# Altium project Control BoardPrjPcb.PrjPcb (part 2 of 2)

## Sheet USB.SchDoc
size A4; SheetNumber: 7; SheetTotal: 9
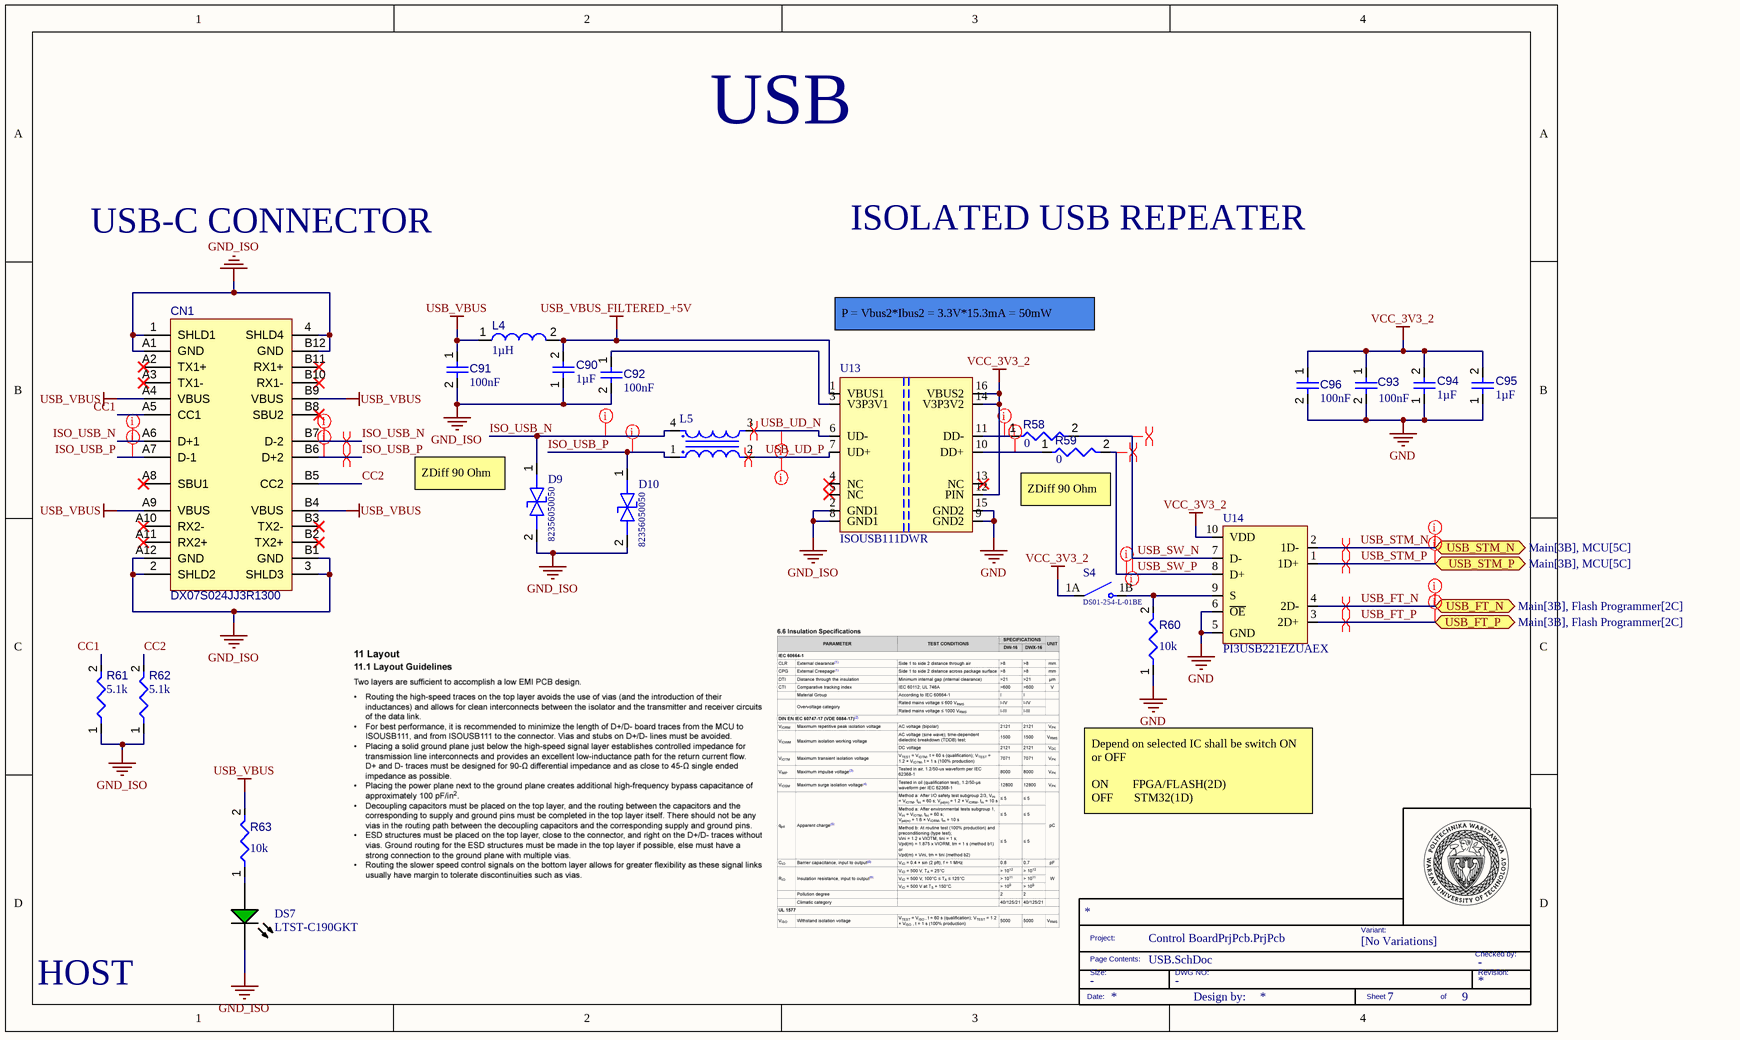
[diagram p5: USB.SchDoc]

### Parts
(Parts that share a designator on the sheet are numbered #1, #2 ... from top to bottom, then left to right.)
*?#5  TITLE_BLOCK  (value not drawn)  (graphical)
C90  value 1µF  [FP-CL10-IPC_C]  (hidden comment: CL10B105KA8NFNC)
C91  value 100nF  [FP-C0603C-CF-IPC_B]  (hidden comment: C0603C104K5RAC7411)
C92  value 100nF  [FP-C0603C-CF-IPC_B]  (hidden comment: C0603C104K5RAC7411)
C93  value 100nF  [FP-C0603C-CF-IPC_C]  (hidden comment: C0603C104K5RAC7411)
C94  value 1µF  [FP-CL10-IPC_B]  (hidden comment: CL10B105KA8NFNC)
C95  value 1µF  [FP-CL10-IPC_B]  (hidden comment: CL10B105KA8NFNC)
C96  value 100nF  [FP-C0603C-CF-IPC_C]  (hidden comment: C0603C104K5RAC7411)
CN1  DX07S024JJ3R1300  [JAE-DX07S024JJ3_V]
D9  82356050050  [0603]
D10  82356050050  [0603]
DS7  LTST-C190GKT  [LTST-C190GKT_V]
L4  value 1µH  [INDC2520X120X60NL20T20]  (hidden comment: LQM2HPN1R0MJ0L)
L5  SRF4532-1R0Y  [SRF4532-1R0Y-Footprint-1]  (value not drawn)
R58  value 0  [RESC0603(1608)_L]  (hidden comment: 0R3J)
R59  value 0  [RESC0603(1608)_L]  (hidden comment: 0R3J)
R60  value 10k  [RESC1608X05N]  (hidden comment: CRCW060310K0FKTC)
R61  value 5.1k  [RESC1608X55X25LL10T15]  (hidden comment: 0603SAF5101T5E)
R62  value 5.1k  [RESC1608X55X25LL10T15]  (hidden comment: 0603SAF5101T5E)
R63  value 10k  [RESC1608X05N]  (hidden comment: CRCW060310K0FKTC)
S4  DS01-254-L-01BE  [SW_DS01-254-L-01BE]
U13  ISOUSB111DWR  [SOIC127P1030X265-16N]
U14  PI3USB221EZUAEX  [PI3USB221EZUAEX-Footprint-1]

### Ports
USB_FT_N (bidir, see Main[3B], Flash Programmer[2C]), USB_FT_P (bidir, see Main[3B], Flash Programmer[2C]), USB_STM_N (bidir, see Main[3B], MCU[5C]), USB_STM_P (bidir, see Main[3B], MCU[5C])

### Nets
GND: C93.2 C94.1 C95.1 C96.2 R60.1 U13.9(GND2) U13.15(GND2) U14.5(GND) U14.6(~{OE})
GND_ISO: C90.1 C91.2 C92.2 CN1.1(SHLD1) CN1.2(SHLD2) CN1.3(SHLD3) CN1.4(SHLD4) CN1.A1(GND) CN1.A12(GND) CN1.B1(GND) CN1.B12(GND) D9.2(A) D10.2(A) DS7.2(K) R61.1 R62.1 U13.2(GND1) U13.8(GND1)
USB_VBUS: C91.1 CN1.A4(VBUS) CN1.A9(VBUS) CN1.B4(VBUS) CN1.B9(VBUS) L4.1 R63.2
USB_VBUS_FILTERED_+5V: C90.2 L4.2 U13.1(VBUS1)
VCC_3V3_2: C93.1 C94.2 C95.2 C96.1 S4.1A(COM1) U13.12(PIN) U13.14(V3P3V2) U13.16(VBUS2) U14.10(VDD)
CC1: CN1.A5(CC1) R61.2
CC2: CN1.B5(CC2) R62.2
ISO_USB_N: CN1.A6(D+1) CN1.B7(D-2) D9.1(K) L5.4
ISO_USB_P: CN1.A7(D-1) CN1.B6(D+2) D10.1(K) L5.1
USB_FT_N: U14.4(2D-) ; port USB_FT_N
USB_FT_P: U14.3(2D+) ; port USB_FT_P
USB_STM_N: U14.2(1D-) ; port USB_STM_N
USB_STM_P: U14.1(1D+) ; port USB_STM_P
USB_SW_N: R58.2 U14.7(D-)
USB_SW_P: R59.2 U14.8(D+)
USB_UD_N: L5.3 U13.6(UD-)
USB_UD_P: L5.2 U13.7(UD+)
NetC92_1: C92.1 U13.3(V3P3V1)
NetDS7_1: DS7.1(A) R63.1
NetR58_1: R58.1 U13.11(DD-)
NetR59_1: R59.1 U13.10(DD+)
NetR60_2: R60.2 S4.1B(NO1) U14.9(S)

Not connected (* = marked no-connect by the designer): CN1 A2(TX1+)* A3(TX1-)* A8(SBU1)* A10(RX2-)* A11(RX2+)* B2(TX2+)* B3(TX2-)* B8(SBU2)* B10(RX1-)* B11(RX1+)*; U13 4(NC)* 5(NC)* 13(NC)*

### Layout directives
differential pair: ISO_USB_N, ISO_USB_P, USB_FT_N, USB_FT_P, USB_STM_N, USB_STM_P, USB_SW_N, USB_SW_P, USB_UD_N, USB_UD_P
mark named USB: ISO_USB_N, ISO_USB_P, NetR58_1, NetR59_1, USB_FT_N, USB_FT_P, USB_STM_N, USB_STM_P, USB_SW_N, USB_SW_P, USB_UD_N, USB_UD_P

### Notes on the sheet
- USB
- USB-C CONNECTOR
- ISOLATED USB REPEATER
- P = Vbus2*Ibus2 = 3.3V*15.3mA = 50mW
- (near D9) ZDiff 90 Ohm
- (near R59) ZDiff 90 Ohm
- Depend on selected IC shall be switch ON or OFF
  ON        FPGA/FLASH(2D)
  OFF       STM32(1D)
- HOST
- (in symbol CMP-003-000005-7) Variant:; Project:; [No Variations]; Checked by:; Page Contents:; Size:; DWG NO:; Revision:; Date:; Design by:; Sheet; of

### Library data of the parts
*?#5 = CMP-003-000005-7: TITLEBLOCK; DWG NO: -; Size: -; Checked by: -; Design Item ID: TITLE_BLOCK; Source: TITLEBLOCK.SchLib
C90 C94 C95 = CMP-001-00085-5: Ceramic Capacitor, Multilayer, Ceramic, 25V, 10% +Tol, 10% -Tol, X7R, 15% TC, 1uF, Surface Mount, 0603; Max Operating Temperature: 125°C; Pins: 2; RoHS Compliant: Yes; Min Operating Temperature: -55°C; Capacitor Type: Ceramic; Mounting Technology: Surface Mount; Case/Package: 0603
C91-C93 C96 = CMP-001-00086-8: Ceramic Capacitor, Multilayer, Ceramic, 50V, 10% +Tol, 10% -Tol, X7R, 15% TC, 0.1uF, Surface Mount, 0603; Capacitor Type: Ceramic; Max Operating Temperature: 125°C; Case/Package: 0603; Pins: 2; Min Operating Temperature: -55°C; RoHS Compliant: Yes; Mounting Technology: Surface Mount
CN1 = CMP-002-00065-4: USB-C Connector, 20 V, 1.25 A, -30 to 80 degC, RoHS, Tape and Reel; Gender: Receptacle; Connector Type: USB-C; Pins: 28
D9 D10 = CMP-004-00031-1: Trans Voltage Suppressor Diode, 5V V(RWM), Bidirectional, 1 Element, Silicon; Peak Inverse Voltage: 75V; Case/Package: 0603; Min Operating Temperature: -40°C; Max Operating Temperature: 85°C; RoHS Compliant: Yes; Pins: 2
DS7 = CMP-007-00022-2: LED Uni-Color Green, 100 mW, 30 mA, -55 to 85 degC, 2-Pin SMD, RoHS, Tape and Reel; Manufacturer: Lite-On; Power: 100mW; Forward Voltage: 2.1V; Viewing Angle: 130degrees; Forward Current: 20mA; Luminous Intensity: 6mcd; Lens Style: Clear; Manufacturer URL: http://www.us.liteon.com/; RoHS Compliant: True; Colour: Green; Package Description: 2-Pin Surface Mount Device, Body 1.6 x 0.8 mm; Datasheet URL: http://datasheet.octopart.com/LTST-C190GKT-Lite-On-datasheet-158530.pdf; Datasheet Version: Dec-06; Mounting Technology: SM; Case/Package: 0603; Package Reference: C190GKT; Packaging: TapeandReel; Min Operating Temperature: -55°C; Nominal Vf: 2.1V; Package Quantity: 3000; Illumination Colour: Green; Max Operating Temperature: 85°C; Pins: 2
L4 = CMP-006-00008-6: Chip Inductor, 1 uH, +/- 20%, 1 MHz, -55 to 125 degC, 1008 (2520 Metric), RoHS, Tape and Reel; Manufacturer: Murata; Self Resonant Frequency: 70MHz; Current Rating: 1.5A; Shielding: Shielded; Core Material: Ferrite; Resistance: 0.09Ohm; Datasheet URL: http://psearch.en.murata.com/inductor/product/LQM2HPN1R0MJ0%23.pdf; Datasheet Version: Aug-16; RoHS Compliant: True; Case/Package: 1008; Package Description: 2-Pin Surface Mount Device, Body 2.5 x 2 mm; Package Quantity: 3000; Tolerance: 20%; Min Operating Temperature: -40°C; Package Reference: 1008; Packaging: TapeandReel; Mounting Technology: SM; Max Operating Temperature: 85°C
L5 = CMP-006-00026-1: Data Line Filter, 2 Function(s), 50V, 1.2A, 4 Pin(s); RoHS Compliant: Yes
R58 R59 = CMP-009-00063-3: Jumper 0603 (1608 Metric); Case/Package: 0603; Mounting Technology: SMT; Pins: 2
R60 R63 = CMP-009-00187-2: Fixed Resistor, Metal Glaze/thick Film, 0.1W, 10000ohm, 75V, 1% +/-Tol, 100ppm/Cel, Surface Mount, 0603; Power: 100mW; Voltage Rating: 75V; Case/Package: 0603; Tolerance: 1%; Min Operating Temperature: -55°C; Mounting Technology: Surface Mount; Max Operating Temperature: 155°C; RoHS Compliant: No; Pins: 2
R61 R62 = CMP-009-00212-2: Chip Resistor, 5.1 KOhm, +/- 1%, 01 W, -55 to 155 degC, 0603 (1608 Metric); Power: 100mW; Voltage Rating: 50V; Case/Package: 0603; RoHS Compliant: True; Max Operating Temperature: 155°C; Min Operating Temperature: -55°C; Tolerance: 1%; Mounting Technology: SM; Pins: 2
S4 = CMP-011-00013-2: 1 Position, Through Hole, 2.54 mm Pitch, Raised Slide Actuator, Flat Bottom, Long Pin, DIP Switch; MF: CUI Devices; SnapEDA_Link: https://www.snapeda.com/parts/DS01-254-L-01BE/CUI+Devices/view-part/?ref=snap; Purchase-URL: https://pricing.snapeda.com/search/part/DS01-254-L-01BE/?ref=eda; Price: None; Value: *; MP: DS01-254-L-01BE; Component Type: Standard; CUI_purchase_URL: https://www.cuidevices.com/product/switches/dip-switches/ds01-254-series?utm_source=snapeda.com&utm_medium=referral&utm_campaign=snapedaBOM; Case/Package: None; Design Item ID: DS01-254-L-01BE; Pins: 2; Check_prices: https://www.snapeda.com/parts/DS01-254-L-01BE/CUI+Devices/view-part/?ref=eda; Source: DS01-254-L-01BE.SchLib; Availability: In Stock
U13 = CMP-031-00011-4: USB Interface IC Low emissions, full/low speed isolated USB repeater; Min Supply Voltage: 4.25V; Max Supply Voltage: 5.5V; Case/Package: SOIC-16; Min Operating Temperature: -40°C; Max Operating Temperature: 125°C; Pins: 16
U14 = CMP-031-00023-2: Analog Multiplexer Single 1: 2 10-Pin UQFN T/R; Pins: 10; Min Operating Temperature: -40°C; RoHS Compliant: Yes; Max Operating Temperature: 85°C

## Sheet Flash.SchDoc
size A4; SheetNumber: 5; SheetTotal: 9
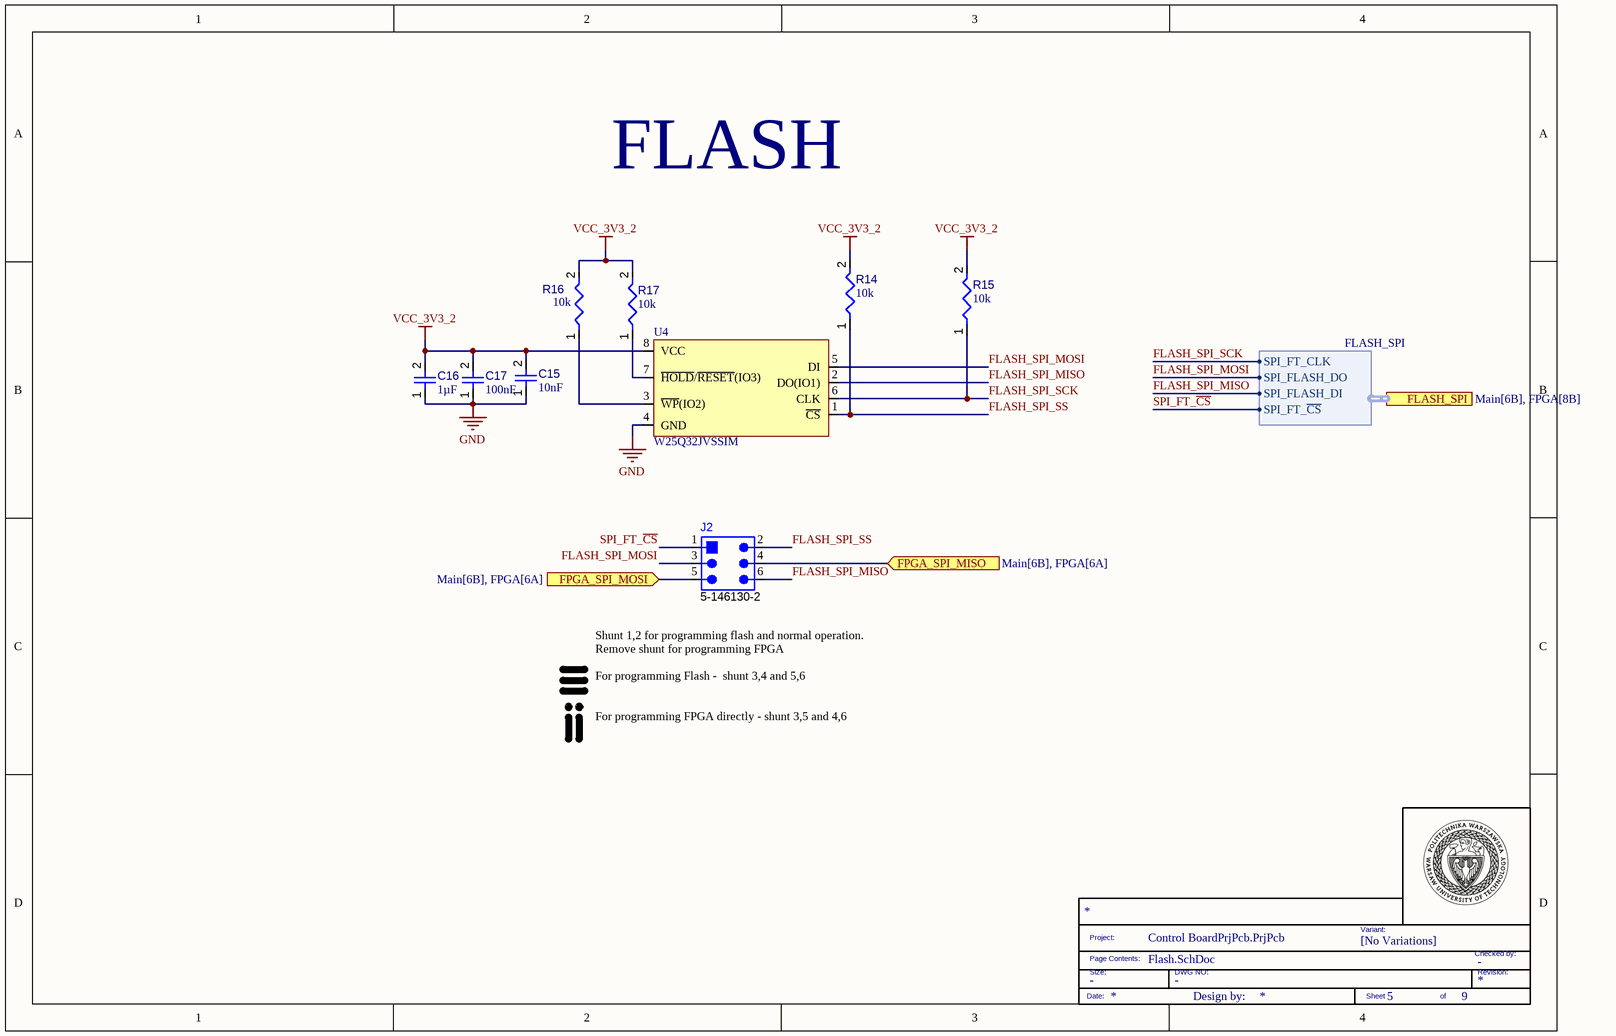
[diagram p6: Flash.SchDoc]

### Parts
(Parts that share a designator on the sheet are numbered #1, #2 ... from top to bottom, then left to right.)
*#2  TITLE_BLOCK  (value not drawn)  (graphical)
C15  value 10nF  [CAPC1608X90X35LL10T15]  (hidden comment: GCM188R71H103KA37J)
C16  value 1µF  [FP-CL10-IPC_C]  (hidden comment: CL10B105KA8NFNC)
C17  value 100nF  [FP-C0603C-CF-IPC_C]  (hidden comment: C0603C104K5RAC7411)
J2  5-146130-2  [TECO-5-146130-2_V]
R14  value 10k  [RESC1608X05N]  (hidden comment: CRCW060310K0FKTC)
R15  value 10k  [RESC1608X05N]  (hidden comment: CRCW060310K0FKTC)
R16  value 10k  [RESC1608X05N]  (hidden comment: CRCW060310K0FKTC)
R17  value 10k  [RESC1608X05N]  (hidden comment: CRCW060310K0FKTC)
U4  W25Q32JVSSIM  [SOIC127P790X175-8N]

### Ports
FLASH_SPI (harness FLASH_SPI, see Main[6B], FPGA[8B]), FPGA_SPI_MISO (in, see Main[6B], FPGA[6A]), FPGA_SPI_MOSI (in, see Main[6B], FPGA[6A])

### Harnesses
FLASH_SPI: SPI_FT_CLK, SPI_FLASH_DO, SPI_FLASH_DI, SPI_FT_~{CS}

### Nets
GND: C15.1 C16.1 C17.1 U4.4(GND)
VCC_3V3_2: C15.2 C16.2 C17.2 R14.2 R15.2 R16.2 R17.2 U4.8(VCC)
FLASH_SPI_MISO: J2.6 U4.2(DO(IO1)) ; port FLASH_SPI.SPI_FLASH_DI
FLASH_SPI_MOSI: J2.3 U4.5(DI) ; port FLASH_SPI.SPI_FLASH_DO
FLASH_SPI_SCK: R15.1 U4.6(CLK) ; port FLASH_SPI.SPI_FT_CLK
FLASH_SPI_SS: J2.2 R14.1 U4.1(~{CS})
FPGA_SPI_MISO: J2.4 ; port FPGA_SPI_MISO
FPGA_SPI_MOSI: J2.5 ; port FPGA_SPI_MOSI
SPI_FT_~{CS}: J2.1 ; port FLASH_SPI.SPI_FT_~{CS}  [project net SPI_FPGA_~{CS}]
NetR16_1: R16.1 U4.3(~{WP}(IO2))
NetR17_1: R17.1 U4.7(~{HOLD}/~{RESET}(IO3))

### Notes on the sheet
- FLASH
- (near J2) Shunt 1,2 for programming flash and normal operation. Remove shunt for programming FPGA
  For programming Flash -  shunt 3,4 and 5,6
  For programming FPGA directly - shunt 3,5 and 4,6
- (in symbol CMP-003-000005-7) Variant:; Project:; [No Variations]; Checked by:; Page Contents:; Size:; DWG NO:; Revision:; Date:; Design by:; Sheet; of

### Library data of the parts
*#2 = CMP-003-000005-7: TITLEBLOCK; DWG NO: -; Size: -; Checked by: -; Design Item ID: TITLE_BLOCK; Source: TITLEBLOCK.SchLib
C15 = CMP-001-00231-2: Ceramic Capacitor, Multilayer, Ceramic, 50V, 10% +Tol, 10% -Tol, X7R, 15% TC, 0.01uF, Surface Mount, 0603; Min Operating Temperature: -55°C; Voltage Rating: 50V; Max Operating Temperature: 125°C; Tolerance: 10%; Capacitor Type: Ceramic; Mounting Technology: Surface Mount; RoHS Compliant: Yes; Case/Package: 0603; Pins: 2
C16 = CMP-001-00085-5: as C90 on sheet USB; Max Operating Temperature: 125°C; Pins: 2; RoHS Compliant: Yes; Min Operating Temperature: -55°C; Capacitor Type: Ceramic; Mounting Technology: Surface Mount; Case/Package: 0603
C17 = CMP-001-00086-8: as C91 on sheet USB; Capacitor Type: Ceramic; Max Operating Temperature: 125°C; Case/Package: 0603; Pins: 2; Min Operating Temperature: -55°C; RoHS Compliant: Yes; Mounting Technology: Surface Mount
J2 = CMP-002-00018-3: Male Header, Pitch 2.54 mm, 2 x 3 Position, Height 8.13 mm, -65 to 125 degC, RoHS, Tube; Manufacturer: TE Connectivity; Datasheet Version: Oct-15; RoHS Compliant: Unknown; Min Operating Temperature: -65°C; Max Operating Temperature: 125°C; Datasheet URL: http://www.te.com/commerce/DocumentDelivery/DDEController?Action=showdoc&DocId=Customer+Drawing%7F146130%7FM%7Fpdf%7FEnglish%7FENG_CD_146130_M.pdf%7F5-146130-2; Package Reference: 5-146130-2; Manufacturer URL: http://www.te.com/; Mounting Technology: SM; Package Description: Male Header, Pitch 2.54 mm, 2 x 3 Position, Height 8.13 mm; Connector Type: Header; Case/Package: 5-146130-2; Gender: Male
R14-R17 = CMP-009-00187-2: as R60 on sheet USB; Voltage Rating: 75V; Case/Package: 0603; Tolerance: 1%; Min Operating Temperature: -55°C; Mounting Technology: Surface Mount; Max Operating Temperature: 155°C; RoHS Compliant: No; Pins: 2
U4 = CMP-019-00049-1: Flash, 4MX8, PDSO8; Memory Size: 4194304; Max Supply Voltage: 3.6V; Min Supply Voltage: 2.7V; Clock Frequency: 133MHz; RoHS Compliant: Yes; Memory Format: FLASH; Pins: 8; Max Operating Temperature: 85°C; Case/Package: SOP; Min Operating Temperature: -40°C

## Sheet Flash Programmer.SchDoc
size A4; SheetNumber: 4; SheetTotal: 9
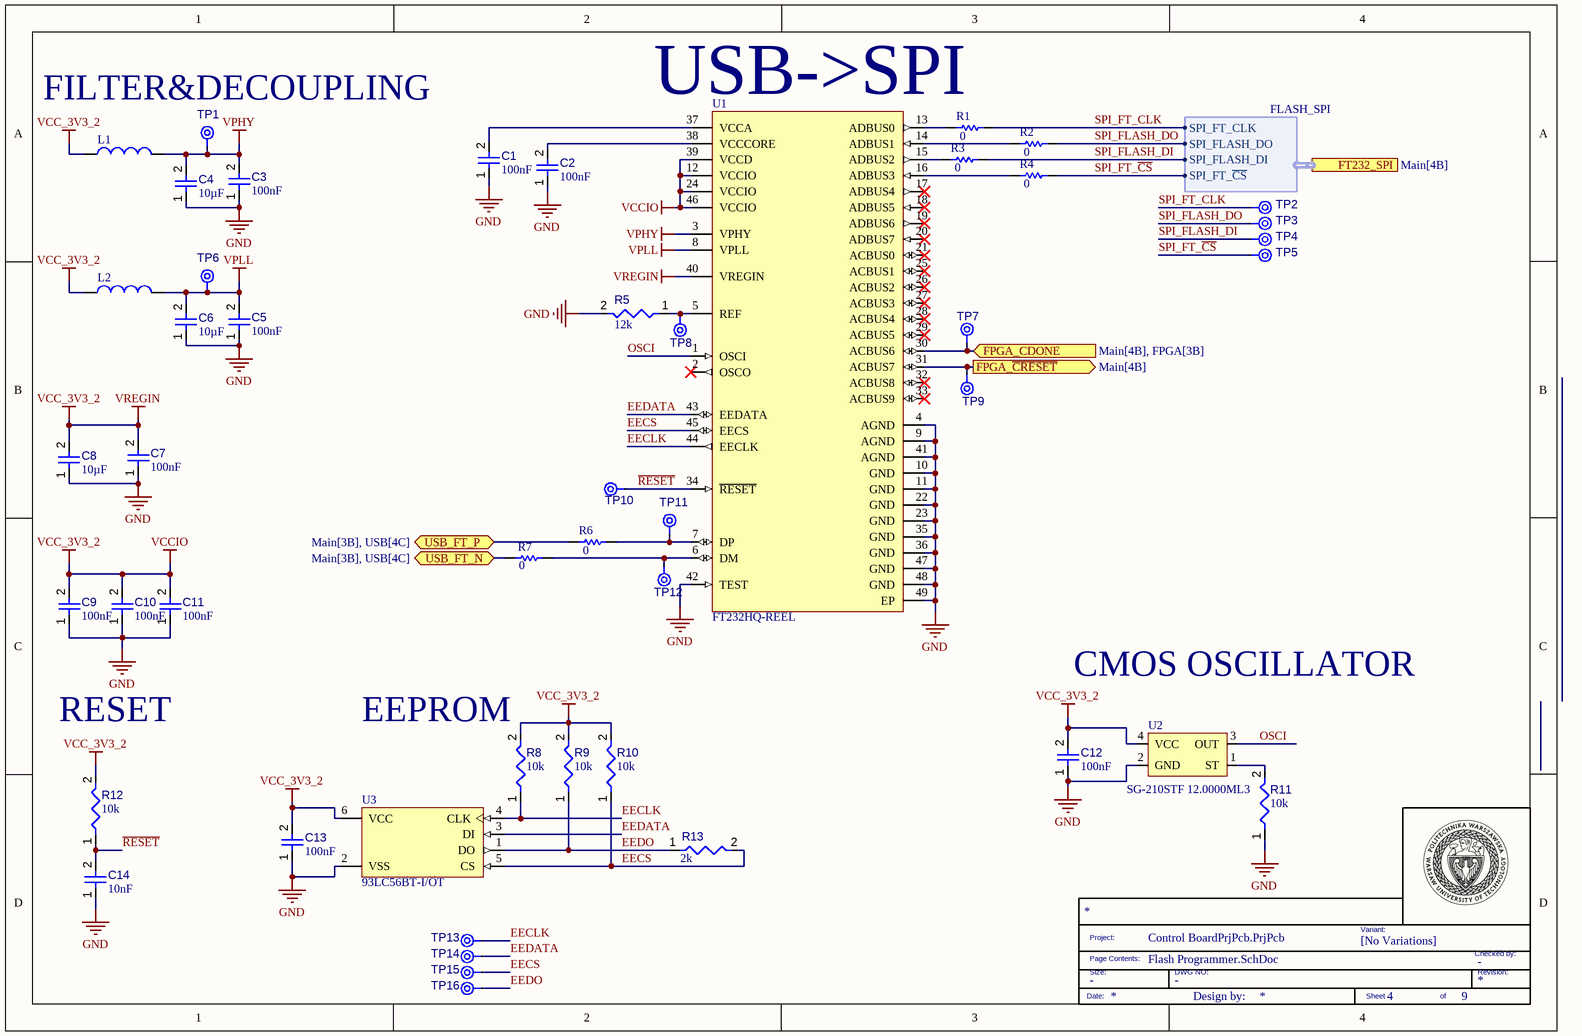
[diagram p7: Flash Programmer.SchDoc]

### Parts
(Parts that share a designator on the sheet are numbered #1, #2 ... from top to bottom, then left to right.)
*?#6  TITLE_BLOCK  (value not drawn)  (graphical)
C1  value 100nF  [FP-C0603C-CF-IPC_C]  (hidden comment: C0603C104K5RAC7411)
C2  value 100nF  [FP-C0603C-CF-IPC_C]  (hidden comment: C0603C104K5RAC7411)
C3  value 100nF  [FP-C0603C-CF-IPC_C]  (hidden comment: C0603C104K5RAC7411)
C4  value 10µF  [FP-GRM188-0_2-IPC_C]  (hidden comment: GRM188R61C106MA73D)
C5  value 100nF  [FP-C0603C-CF-IPC_C]  (hidden comment: C0603C104K5RAC7411)
C6  value 10µF  [FP-GRM188-0_2-IPC_C]  (hidden comment: GRM188R61C106MA73D)
C7  value 100nF  [FP-C0603C-CF-IPC_C]  (hidden comment: C0603C104K5RAC7411)
C8  value 10µF  [FP-GRM188-0_2-IPC_C]  (hidden comment: GRM188R61C106MA73D)
C9  value 100nF  [FP-C0603C-CF-IPC_C]  (hidden comment: C0603C104K5RAC7411)
C10  value 100nF  [FP-C0603C-CF-IPC_C]  (hidden comment: C0603C104K5RAC7411)
C11  value 100nF  [FP-C0603C-CF-IPC_C]  (hidden comment: C0603C104K5RAC7411)
C12  value 100nF  [FP-C0603C-CF-IPC_C]  (hidden comment: C0603C104K5RAC7411)
C13  value 100nF  [FP-C0603C-CF-IPC_C]  (hidden comment: C0603C104K5RAC7411)
C14  value 10nF  [CAPC1608X90X35LL10T15]  (hidden comment: GCM188R71H103KA37J)
L1  MPZ1608Y101BTA00  [FP-MPZ1608-0_8-IPC_C]  (value not drawn)
L2  MPZ1608Y101BTA00  [FP-MPZ1608-0_8-IPC_C]  (value not drawn)
R1  value 0  [RESC1005X40X25ML05T10]  (hidden comment: Resistor 0R 0402 63 mW)
R2  value 0  [RESC1005X40X25ML05T10]  (hidden comment: Resistor 0R 0402 63 mW)
R3  value 0  [RESC1005X40X25ML05T10]  (hidden comment: Resistor 0R 0402 63 mW)
R4  value 0  [RESC1005X40X25ML05T10]  (hidden comment: Resistor 0R 0402 63 mW)
R5  value 12k  [RESC1608X06N]  (hidden comment: RCS060312K0FKEA)
R6  value 0  [RESC1005X40X25ML05T10]  (hidden comment: Resistor 0R 0402 63 mW)
R7  value 0  [RESC1005X40X25ML05T10]  (hidden comment: Resistor 0R 0402 63 mW)
R8  value 10k  [RESC1608X05N]  (hidden comment: CRCW060310K0FKTC)
R9  value 10k  [RESC1608X05N]  (hidden comment: CRCW060310K0FKTC)
R10  value 10k  [RESC1608X05N]  (hidden comment: CRCW060310K0FKTC)
R11  value 10k  [RESC1608X05N]  (hidden comment: CRCW060310K0FKTC)
R12  value 10k  [RESC1608X05N]  (hidden comment: CRCW060310K0FKTC)
R13  value 2k  [RESC1608X06N]  (hidden comment: CRCW06032K00FKEAC)
TP1  TPAD6R  [TP06R]  (value not drawn)  (no BOM)
TP2  TPAD6R  [TP06R]  (value not drawn)  (no BOM)
TP3  TPAD6R  [TP06R]  (value not drawn)  (no BOM)
TP4  TPAD6R  [TP06R]  (value not drawn)  (no BOM)
TP5  TPAD6R  [TP06R]  (value not drawn)  (no BOM)
TP6  TPAD6R  [TP06R]  (value not drawn)  (no BOM)
TP7  TPAD6R  [TP06R]  (value not drawn)  (no BOM)
TP8  TPAD6R  [TP06R]  (value not drawn)  (no BOM)
TP9  TPAD6R  [TP06R]  (value not drawn)  (no BOM)
TP10  TPAD6R  [TP06R]  (value not drawn)  (no BOM)
TP11  TPAD6R  [TP06R]  (value not drawn)  (no BOM)
TP12  TPAD6R  [TP06R]  (value not drawn)  (no BOM)
TP13  TPAD6R  [TP06R]  (value not drawn)  (no BOM)
TP14  TPAD6R  [TP06R]  (value not drawn)  (no BOM)
TP15  TPAD6R  [TP06R]  (value not drawn)  (no BOM)
TP16  TPAD6R  [TP06R]  (value not drawn)  (no BOM)
U1  FT232HQ-REEL  [FP-QFN-48-IPC_A]
U2  SG-210STF 12.0000ML3  [SG-210STF 12.0000ML3-Footprint-1]
U3  93LC56BT-I/OT  [FP-C04-028-MFG]

### Ports
FPGA_CDONE (in, see Main[4B], FPGA[3B]), FPGA_~{CRESET} (out, see Main[4B]), FT232_SPI (harness FLASH_SPI, see Main[4B]), USB_FT_N (bidir, see Main[3B], USB[4C]), USB_FT_P (bidir, see Main[3B], USB[4C])

### Harnesses
FLASH_SPI: SPI_FT_CLK, SPI_FLASH_DO, SPI_FLASH_DI, SPI_FT_~{CS}

### Nets
GND: C1.1 C2.1 C3.1 C4.1 C5.1 C6.1 C7.1 C8.1 C9.1 C10.1 C11.1 C12.1 C13.1 C14.1 R5.2 R11.1 U1.4(AGND) U1.9(AGND) U1.10(GND) U1.11(GND) U1.22(GND) U1.23(GND) U1.35(GND) U1.36(GND) U1.41(AGND) U1.42(TEST) U1.47(GND) U1.48(GND) U1.49(EP) U2.2(GND) U3.2(VSS)
VCC_3V3_2: C7.2 C8.2 C9.2 C10.2 C11.2 C12.2 C13.2 L1.1 L2.1 R8.2 R9.2 R10.2 R12.2 U1.12(VCCIO) U1.24(VCCIO) U1.39(VCCD) U1.40(VREGIN) U1.46(VCCIO) U2.4(VCC) U3.6(VCC)  [also labelled VCCIO, VREGIN]
VPHY: C3.2 C4.2 L1.2 TP1.1(TP) U1.3(VPHY)
VPLL: C5.2 C6.2 L2.2 TP6.1(TP) U1.8(VPLL)
~{RESET}: C14.2 R12.1 TP10.1(TP) U1.34(~{RESET})
~{CRESET}: TP9.1(TP) U1.31(ACBUS7) ; port FPGA_~{CRESET}
CDONE: TP7.1(TP) U1.30(ACBUS6) ; port FPGA_CDONE
EECLK: R8.1 TP13.1(TP) U1.44(EECLK) U3.4(CLK)
EECS: R10.1 R13.2 TP15.1(TP) U1.45(EECS) U3.5(CS)
EEDATA: TP14.1(TP) U1.43(EEDATA) U3.3(DI)
EEDO: R9.1 R13.1 TP16.1(TP) U3.1(DO)
OSCI: U1.1(OSCI) U2.3(OUT)
SPI_FLASH_DI: R3.2 TP4.1(TP) ; port FT232_SPI.SPI_FLASH_DI  [project net FLASH_SPI_MISO]
SPI_FLASH_DO: R2.2 TP3.1(TP) ; port FT232_SPI.SPI_FLASH_DO  [project net FLASH_SPI_MOSI]
SPI_FT_~{CS}: R4.2 TP5.1(TP) ; port FT232_SPI.SPI_FT_~{CS}  [project net SPI_FPGA_~{CS}]
SPI_FT_CLK: R1.2 TP2.1(TP) ; port FT232_SPI.SPI_FT_CLK  [project net FLASH_SPI_SCK]
USB_FT_N: R7.1 ; port USB_FT_N
USB_FT_P: R6.1 ; port USB_FT_P
NetC1_2: C1.2 U1.37(VCCA)
NetC2_2: C2.2 U1.38(VCCCORE)
NetR1_1: R1.1 U1.13(ADBUS0)
NetR2_1: R2.1 U1.14(ADBUS1)
NetR3_1: R3.1 U1.15(ADBUS2)
NetR4_1: R4.1 U1.16(ADBUS3)
NetR5_1: R5.1 TP8.1(TP) U1.5(REF)
NetR6_2: R6.2 TP11.1(TP) U1.7(DP)
NetR7_2: R7.2 TP12.1(TP) U1.6(DM)
NetR11_2: R11.2 U2.1(ST)

Not connected (* = marked no-connect by the designer): U1 2(OSCO)* 17(ADBUS4)* 18(ADBUS5)* 19(ADBUS6)* 20(ADBUS7)* 21(ACBUS0)* 25(ACBUS1)* 26(ACBUS2)* 27(ACBUS3)* 28(ACBUS4)* 29(ACBUS5)* 32(ACBUS8)* 33(ACBUS9)*

### Notes on the sheet
- FILTER&DECOUPLING
- USB->SPI
- CMOS OSCILLATOR
- RESET
- (near R8) EEPROM
- (in symbol CMP-003-000005-7) Variant:; Project:; [No Variations]; Checked by:; Page Contents:; Size:; DWG NO:; Revision:; Date:; Design by:; Sheet; of

### Library data of the parts
*?#6 = CMP-003-000005-7: TITLEBLOCK; DWG NO: -; Size: -; Checked by: -; Design Item ID: TITLE_BLOCK; Source: TITLEBLOCK.SchLib
C1-C3 C5 C7 C9-C13 = CMP-001-00086-8: as C91 on sheet USB; Capacitor Type: Ceramic; Max Operating Temperature: 125°C; Case/Package: 0603; Pins: 2; Min Operating Temperature: -55°C; RoHS Compliant: Yes; Mounting Technology: Surface Mount
C4 C6 C8 = CMP-001-00241-5: Ceramic Capacitor, Multilayer, Ceramic, 16V, 20% +Tol, 20% -Tol, X5R, 15% TC, 10uF, Surface Mount, 0603; Min Operating Temperature: -55°C; Capacitor Type: Ceramic; RoHS Compliant: Yes; Max Operating Temperature: 85°C; Case/Package: 0603; Mounting Technology: Surface Mount; Pins: 2
C14 = CMP-001-00231-2: as C15 on sheet Flash; Min Operating Temperature: -55°C; Voltage Rating: 50V; Max Operating Temperature: 125°C; Tolerance: 10%; Capacitor Type: Ceramic; Mounting Technology: Surface Mount; RoHS Compliant: Yes; Case/Package: 0603; Pins: 2
L1 L2 = CMP-006-00024-5: Ferrite Chip, 1 Function(s), 2A, 2 Pin(s); Tolerance: 25%; Current Rating: 2A; RoHS Compliant: Yes; Pins: 2; Max Operating Temperature: 125°C; Mounting Technology: Surface Mount; Case/Package: 0603; Min Operating Temperature: -55°C; Max Current Rating: 2A
R1-R4 R6 R7 = CMP-009-00004-6: Chip Resistor, 0 Ohm, 0.063 W, -55 to 155 degC, 0402 (1005 Metric); Power: 63mW; Voltage Rating: 50V; Case/Package: 0402; Max Operating Temperature: 155°C; RoHS Compliant: True; Mounting Technology: SM; Min Operating Temperature: -55°C; Pins: 2
R5 = CMP-009-00198-2: Fixed Resistor, Metal Glaze/thick Film, 0.25W, 12000ohm, 75V, 1% +/-Tol, 100ppm/Cel, Surface Mount, 0603; Power: 250mW; Pins: 2; Tolerance: 1%; Voltage Rating: 75V; Case/Package: 0603
R8-R12 = CMP-009-00187-2: as R60 on sheet USB; Voltage Rating: 75V; Case/Package: 0603; Tolerance: 1%; Min Operating Temperature: -55°C; Mounting Technology: Surface Mount; Max Operating Temperature: 155°C; RoHS Compliant: No; Pins: 2
R13 = CMP-009-00199-2: Fixed Resistor, Metal Glaze/thick Film, 0.1W, 2000ohm, 75V, 1% +/-Tol, 100ppm/Cel, Surface Mount, 0603; Power: 100mW; Pins: 2; RoHS Compliant: Yes; Tolerance: 1%; Max Operating Temperature: 155°C; Case/Package: 0603; Mounting Technology: Surface Mount; Min Operating Temperature: -55°C
TP1-TP16 = CMP-00028-00002-3: 0.6mm round; Pins: 1
U1 = CMP-031-00017-2: USB Bus Controller, CMOS; Max Supply Voltage: 1.98V; Min Supply Voltage: 1.62V; Min Operating Temperature: -40°C; Max Operating Temperature: 85°C; RoHS Compliant: Yes; Pins: 48; Case/Package: HVQCCN
U2 = CMP-003-00030-6: CMOS Output Clock Oscillator, 12MHz Nom; Load Capacitance: 15pF; Frequency: 12MHz; Max Operating Temperature: 85°C; Min Operating Temperature: -40°C; Pins: 4
U3 = CMP-031-00019-2: EEPROM, 128X16, Serial, CMOS, PDSO6

## Sheet Connector.SchDoc
size A3; SheetNumber: 8; SheetTotal: 9
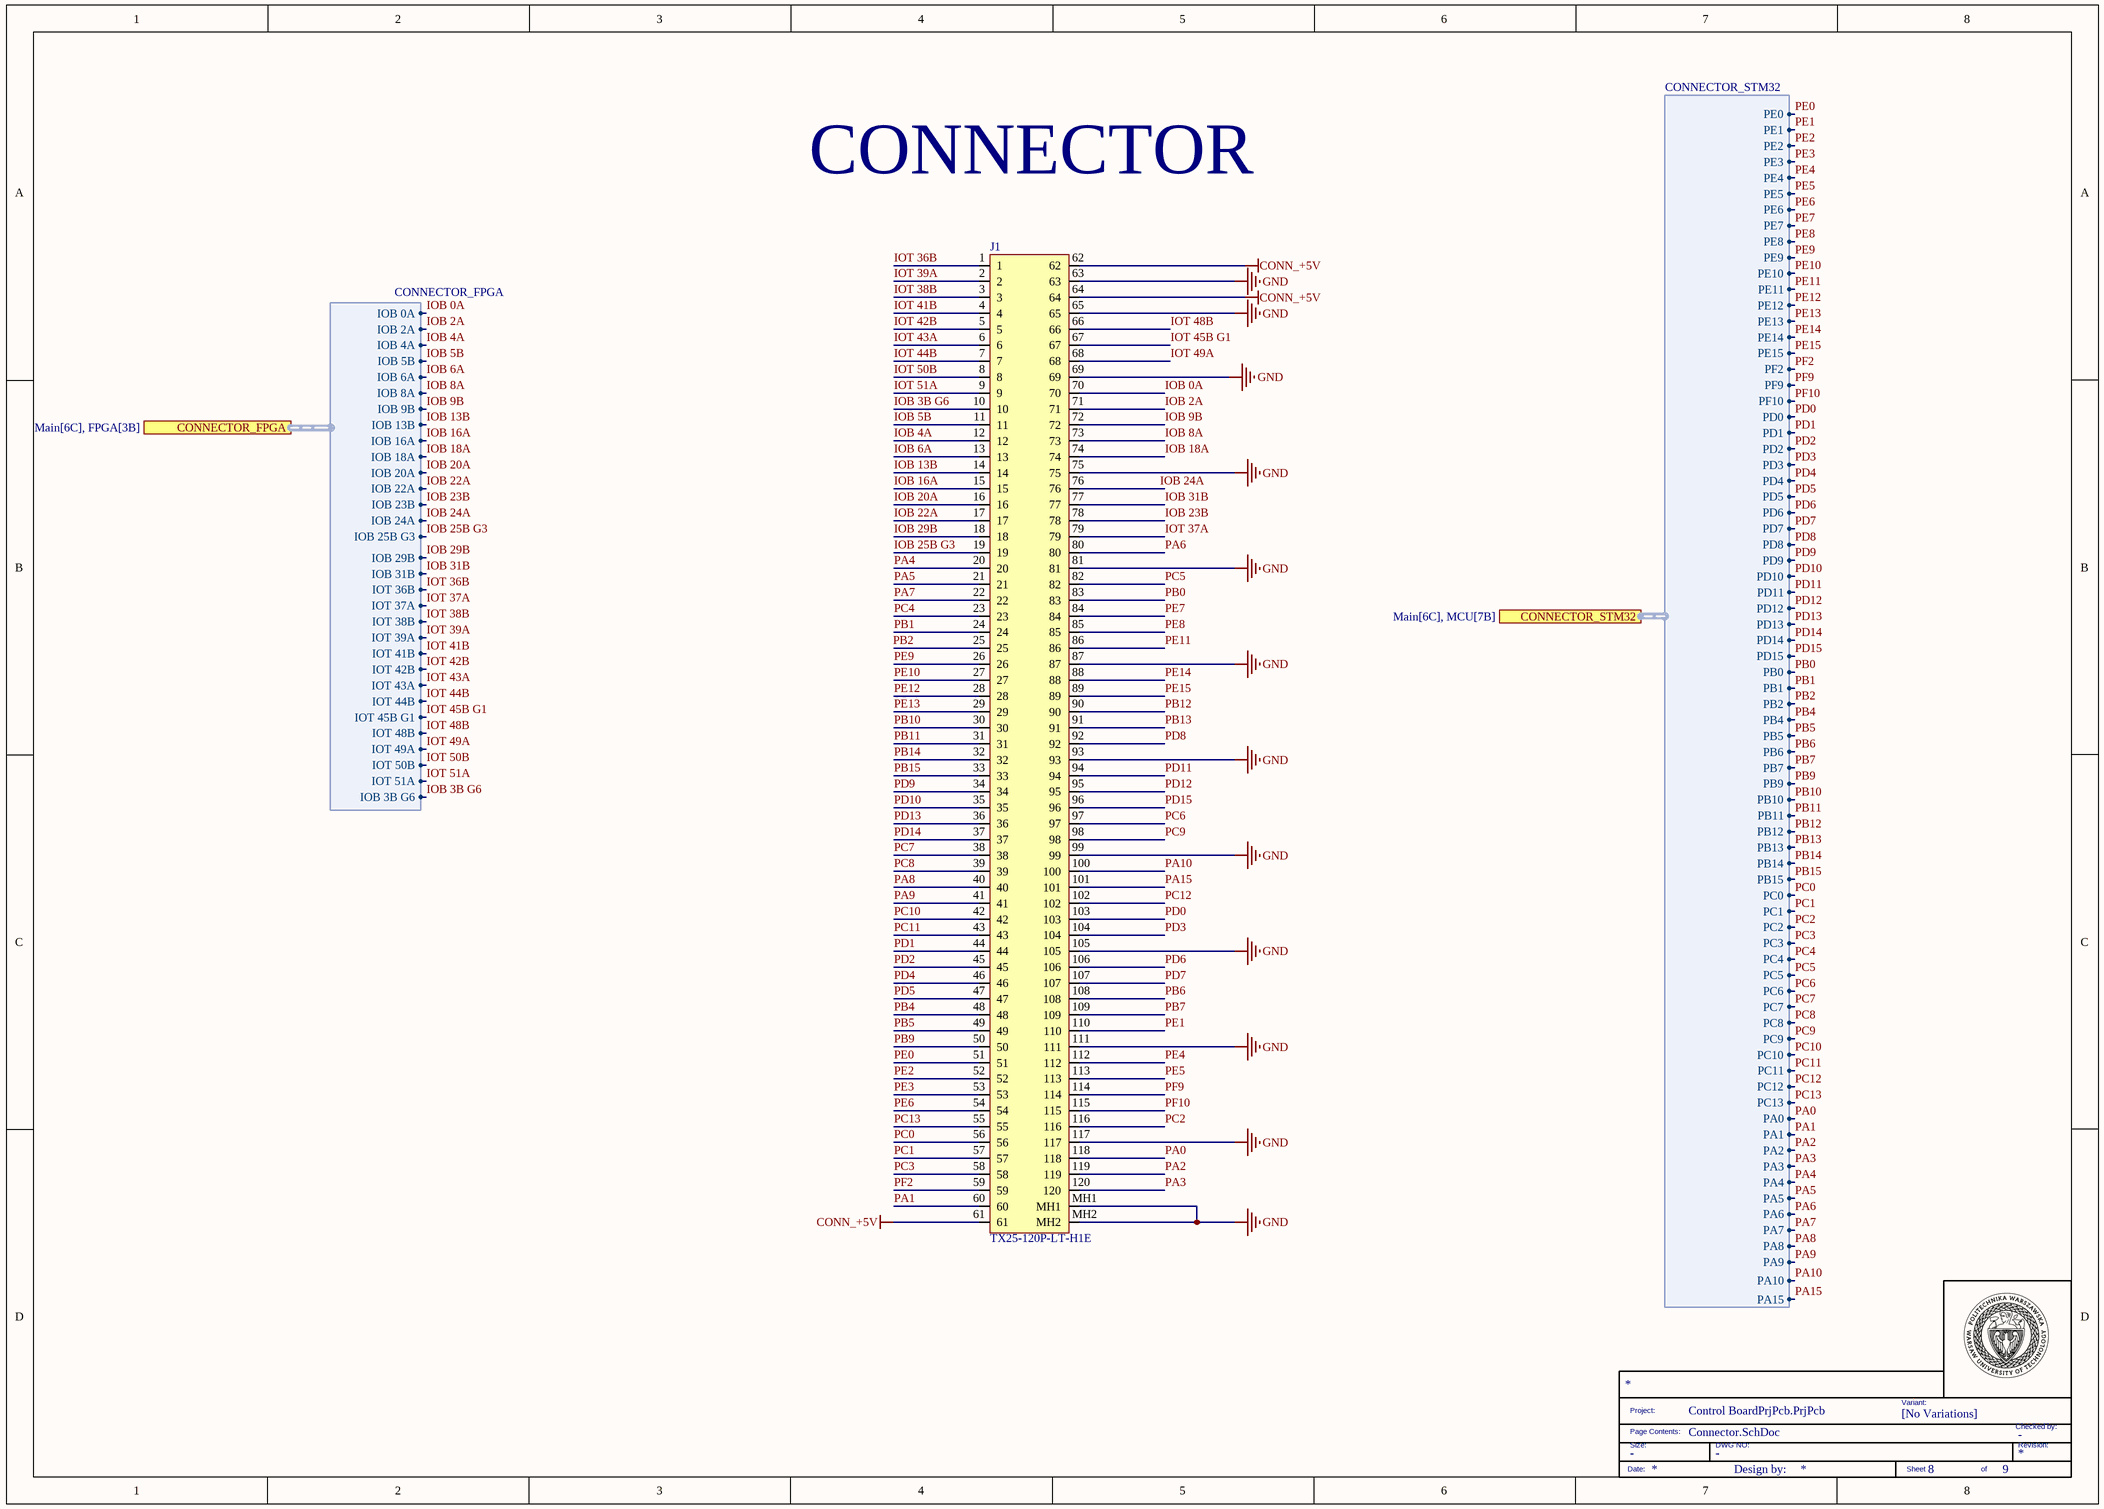
[diagram p8: Connector.SchDoc]

### Parts
(Parts that share a designator on the sheet are numbered #1, #2 ... from top to bottom, then left to right.)
*#3  TITLE_BLOCK  (value not drawn)  (graphical)
J1  TX25-120P-LT-H1E  [TX25120PLTH1E]

### Ports
CONNECTOR_FPGA (harness CONNECTOR_FPGA, see Main[6C], FPGA[3B]), CONNECTOR_STM32 (harness CONNECTOR_STM32, see Main[6C], MCU[7B])

### Harnesses
CONNECTOR_STM32: PE0, PE1, PE2, PE3, PE4, PE5, PE6, PE7, PE8, PE9, PE10, PE11, PE12, PE13, PE14, PE15, PF2, PF9, PF10, PD0, PD1, PD2, PD3, PD4, PD5, PD6, PD7, PD8, PD9, PD10, PD11, PD12, PD13, PD14, PD15, PB0, PB1, PB2, PB4, PB5, PB6, PB7, PB9, PB10, PB11, PB12, PB13, PB14, PB15, PC0, PC1, PC2, PC3, PC4, PC5, PC6, PC7, PC8, PC9, PC10, PC11, PC12, PC13, PA0, PA1, PA2, PA3, PA4, PA5, PA6, PA7, PA8, PA9, PA10, PA15
CONNECTOR_FPGA: IOB 0A, IOB 2A, IOB 4A, IOB 5B, IOB 6A, IOB 8A, IOB 9B, IOB 13B, IOB 16A, IOB 18A, IOB 20A, IOB 22A, IOB 23B, IOB 24A, IOB 25B G3, IOB 29B, IOB 31B, IOT 36B, IOT 37A, IOT 38B, IOT 39A, IOT 41B, IOT 42B, IOT 43A, IOT 44B, IOT 45B G1, IOT 48B, IOT 49A, IOT 50B, IOT 51A, IOB 3B G6

### Nets
CONN_+5V: J1.61 J1.62 J1.64
GND: J1.63 J1.65 J1.69 J1.75 J1.81 J1.87 J1.93 J1.99 J1.105 J1.111 J1.117 J1.MH1 J1.MH2
IOB 0A: J1.70 ; port CONNECTOR_FPGA.IOB 0A
IOB 2A: J1.71 ; port CONNECTOR_FPGA.IOB 2A
IOB 3B G6: J1.10 ; port CONNECTOR_FPGA.IOB 3B G6
IOB 4A: J1.12 ; port CONNECTOR_FPGA.IOB 4A
IOB 5B: J1.11 ; port CONNECTOR_FPGA.IOB 5B
IOB 6A: J1.13 ; port CONNECTOR_FPGA.IOB 6A
IOB 8A: J1.73 ; port CONNECTOR_FPGA.IOB 8A
IOB 9B: J1.72 ; port CONNECTOR_FPGA.IOB 9B
IOB 13B: J1.14 ; port CONNECTOR_FPGA.IOB 13B
IOB 16A: J1.15 ; port CONNECTOR_FPGA.IOB 16A
IOB 18A: J1.74 ; port CONNECTOR_FPGA.IOB 18A
IOB 20A: J1.16 ; port CONNECTOR_FPGA.IOB 20A
IOB 22A: J1.17 ; port CONNECTOR_FPGA.IOB 22A
IOB 23B: J1.78 ; port CONNECTOR_FPGA.IOB 23B
IOB 24A: J1.76 ; port CONNECTOR_FPGA.IOB 24A
IOB 25B G3: J1.19 ; port CONNECTOR_FPGA.IOB 25B G3
IOB 29B: J1.18 ; port CONNECTOR_FPGA.IOB 29B
IOB 31B: J1.77 ; port CONNECTOR_FPGA.IOB 31B
IOT 36B: J1.1 ; port CONNECTOR_FPGA.IOT 36B
IOT 37A: J1.79 ; port CONNECTOR_FPGA.IOT 37A
IOT 38B: J1.3 ; port CONNECTOR_FPGA.IOT 38B
IOT 39A: J1.2 ; port CONNECTOR_FPGA.IOT 39A
IOT 41B: J1.4 ; port CONNECTOR_FPGA.IOT 41B
IOT 42B: J1.5 ; port CONNECTOR_FPGA.IOT 42B
IOT 43A: J1.6 ; port CONNECTOR_FPGA.IOT 43A
IOT 44B: J1.7 ; port CONNECTOR_FPGA.IOT 44B
IOT 45B G1: J1.67 ; port CONNECTOR_FPGA.IOT 45B G1
IOT 48B: J1.66 ; port CONNECTOR_FPGA.IOT 48B
IOT 49A: J1.68 ; port CONNECTOR_FPGA.IOT 49A
IOT 50B: J1.8 ; port CONNECTOR_FPGA.IOT 50B
IOT 51A: J1.9 ; port CONNECTOR_FPGA.IOT 51A
PA0: J1.118 ; port CONNECTOR_STM32.PA0
PA1: J1.60 ; port CONNECTOR_STM32.PA1
PA2: J1.119 ; port CONNECTOR_STM32.PA2
PA3: J1.120 ; port CONNECTOR_STM32.PA3
PA4: J1.20 ; port CONNECTOR_STM32.PA4
PA5: J1.21 ; port CONNECTOR_STM32.PA5
PA6: J1.80 ; port CONNECTOR_STM32.PA6
PA7: J1.22 ; port CONNECTOR_STM32.PA7
PA8: J1.40 ; port CONNECTOR_STM32.PA8
PA9: J1.41 ; port CONNECTOR_STM32.PA9
PA10: J1.100 ; port CONNECTOR_STM32.PA10
PA15: J1.101 ; port CONNECTOR_STM32.PA15
PB0: J1.83 ; port CONNECTOR_STM32.PB0
PB1: J1.24 ; port CONNECTOR_STM32.PB1
PB2: J1.25 ; port CONNECTOR_STM32.PB2
PB4: J1.48 ; port CONNECTOR_STM32.PB4
PB5: J1.49 ; port CONNECTOR_STM32.PB5
PB6: J1.108 ; port CONNECTOR_STM32.PB6
PB7: J1.109 ; port CONNECTOR_STM32.PB7
PB9: J1.50 ; port CONNECTOR_STM32.PB9
PB10: J1.30 ; port CONNECTOR_STM32.PB10
PB11: J1.31 ; port CONNECTOR_STM32.PB11
PB12: J1.90 ; port CONNECTOR_STM32.PB12
PB13: J1.91 ; port CONNECTOR_STM32.PB13
PB14: J1.32 ; port CONNECTOR_STM32.PB14
PB15: J1.33 ; port CONNECTOR_STM32.PB15
PC0: J1.56 ; port CONNECTOR_STM32.PC0
PC1: J1.57 ; port CONNECTOR_STM32.PC1
PC2: J1.116 ; port CONNECTOR_STM32.PC2
PC3: J1.58 ; port CONNECTOR_STM32.PC3
PC4: J1.23 ; port CONNECTOR_STM32.PC4
PC5: J1.82 ; port CONNECTOR_STM32.PC5
PC6: J1.97 ; port CONNECTOR_STM32.PC6
PC7: J1.38 ; port CONNECTOR_STM32.PC7
PC8: J1.39 ; port CONNECTOR_STM32.PC8
PC9: J1.98 ; port CONNECTOR_STM32.PC9
PC10: J1.42 ; port CONNECTOR_STM32.PC10
PC11: J1.43 ; port CONNECTOR_STM32.PC11
PC12: J1.102 ; port CONNECTOR_STM32.PC12
PC13: J1.55 ; port CONNECTOR_STM32.PC13
PD0: J1.103 ; port CONNECTOR_STM32.PD0
PD1: J1.44 ; port CONNECTOR_STM32.PD1
PD2: J1.45 ; port CONNECTOR_STM32.PD2
PD3: J1.104 ; port CONNECTOR_STM32.PD3
PD4: J1.46 ; port CONNECTOR_STM32.PD4
PD5: J1.47 ; port CONNECTOR_STM32.PD5
PD6: J1.106 ; port CONNECTOR_STM32.PD6
PD7: J1.107 ; port CONNECTOR_STM32.PD7
PD8: J1.92 ; port CONNECTOR_STM32.PD8
PD9: J1.34 ; port CONNECTOR_STM32.PD9
PD10: J1.35 ; port CONNECTOR_STM32.PD10
PD11: J1.94 ; port CONNECTOR_STM32.PD11
PD12: J1.95 ; port CONNECTOR_STM32.PD12
PD13: J1.36 ; port CONNECTOR_STM32.PD13
PD14: J1.37 ; port CONNECTOR_STM32.PD14
PD15: J1.96 ; port CONNECTOR_STM32.PD15
PE0: J1.51 ; port CONNECTOR_STM32.PE0
PE1: J1.110 ; port CONNECTOR_STM32.PE1
PE2: J1.52 ; port CONNECTOR_STM32.PE2
PE3: J1.53 ; port CONNECTOR_STM32.PE3
PE4: J1.112 ; port CONNECTOR_STM32.PE4
PE5: J1.113 ; port CONNECTOR_STM32.PE5
PE6: J1.54 ; port CONNECTOR_STM32.PE6
PE7: J1.84 ; port CONNECTOR_STM32.PE7
PE8: J1.85 ; port CONNECTOR_STM32.PE8
PE9: J1.26 ; port CONNECTOR_STM32.PE9
PE10: J1.27 ; port CONNECTOR_STM32.PE10
PE11: J1.86 ; port CONNECTOR_STM32.PE11
PE12: J1.28 ; port CONNECTOR_STM32.PE12
PE13: J1.29 ; port CONNECTOR_STM32.PE13
PE14: J1.88 ; port CONNECTOR_STM32.PE14
PE15: J1.89 ; port CONNECTOR_STM32.PE15
PF2: J1.59 ; port CONNECTOR_STM32.PF2
PF9: J1.114 ; port CONNECTOR_STM32.PF9
PF10: J1.115 ; port CONNECTOR_STM32.PF10

### Notes on the sheet
- CONNECTOR
- (in symbol CMP-003-000005-7) Variant:; Project:; [No Variations]; Checked by:; Page Contents:; Size:; DWG NO:; Revision:; Date:; Design by:; Sheet; of

### Library data of the parts
*#3 = CMP-003-000005-7: TITLEBLOCK; DWG NO: -; Size: -; Checked by: -; Design Item ID: TITLE_BLOCK; Source: TITLEBLOCK.SchLib
J1 = CMP-002-00072-7: Board-to-Board Connector; Manufacturer_Name: JAE; Connector Type: BOARD STACKING CONNECTOR; Design Item ID: TX25-120P-LT-H1E; Mounting Technology: Board; Height: 9.2mm; Manufacturer_Part_Number: TX25-120P-LT-H1E; Source: SamacSys.SchLib; Mouser Part Number: 656-TX25120PLTH1E; Datasheet Link: https://www.jae.com/direct/topics/topics_file_download/topics_id=66775&ext_no=06&_lang=en&v=; Mouser Price/Stock: https://www.mouser.co.uk/ProductDetail/JAE-Electronics/TX25-120P-LT-H1E?qs=X2uUhIUKvwIqaiFkkBAxfw%3D%3D; Min Operating Temperature: -40°C; RoHS Compliant: Yes; Max Operating Temperature: 80°C

## Nets that join several sheets
+1V2: FPGA (R18.1), Power Manage (7 pins)
+2V5: FPGA (R20.1), Power Manage (6 pins)
CONN_+5V: Power Manage (L3.1), Connector (J1.61 J1.62 J1.64)
GND: FPGA (26 pins), MCU (38 pins), Power Manage (51 pins), Mechanical (ST2.1 ST3.1 ST4.1), USB (9 pins), Flash (C15.1 C16.1 C17.1 U4.4), Flash Programmer (31 pins), Connector (13 pins)
GND_ISO: Power Manage (C57.1 C58.1 U9.1), USB (18 pins)
USB_VBUS_FILTERED_+5V: Power Manage (C57.2 C58.2 U9.4), USB (C90.2 L4.2 U13.1)
VCC_3V3_1: FPGA (R19.1), Power Manage (6 pins)
VCC_3V3_2: FPGA (7 pins), MCU (7 pins), Power Manage (6 pins), USB (9 pins), Flash (8 pins), Flash Programmer (20 pins)
~{CRESET}: FPGA (6 pins), Power Manage (R35.2), Flash Programmer (TP9.1 U1.31)
CDONE: FPGA (DS1.1 R24.1 U5.7), Flash Programmer (TP7.1 U1.30)
FLASH_SPI_MISO: Flash (J2.6 U4.2), Flash Programmer (R3.2 TP4.1)
FLASH_SPI_MOSI: Flash (J2.3 U4.5), Flash Programmer (R2.2 TP3.1)
FLASH_SPI_SCK: FPGA (U5.15), Flash (R15.1 U4.6), Flash Programmer (R1.2 TP2.1)
FPGA_SPI_MISO: FPGA (U5.14), Flash (J2.4)
FPGA_SPI_MOSI: FPGA (U5.17), Flash (J2.5)
IOB 0A: FPGA (U5.46), Connector (J1.70)
IOB 2A: FPGA (U5.47), Connector (J1.71)
IOB 3B G6: FPGA (U5.44), Connector (J1.10)
IOB 4A: FPGA (U5.48), Connector (J1.12)
IOB 5B: FPGA (U5.45), Connector (J1.11)
IOB 6A: FPGA (U5.2), Connector (J1.13)
IOB 8A: FPGA (U5.4), Connector (J1.73)
IOB 9B: FPGA (U5.3), Connector (J1.72)
IOB 13B: FPGA (U5.6), Connector (J1.14)
IOB 16A: FPGA (U5.9), Connector (J1.15)
IOB 18A: FPGA (U5.10), Connector (J1.74)
IOB 20A: FPGA (U5.11), Connector (J1.16)
IOB 22A: FPGA (U5.12), Connector (J1.17)
IOB 23B: FPGA (U5.21), Connector (J1.78)
IOB 24A: FPGA (U5.13), Connector (J1.76)
IOB 25B G3: FPGA (U5.20), Connector (J1.19)
IOB 29B: FPGA (U5.19), Connector (J1.18)
IOB 31B: FPGA (U5.18), Connector (J1.77)
IOT 36B: FPGA (U5.25), Connector (J1.1)
IOT 37A: FPGA (U5.23), Connector (J1.79)
IOT 38B: FPGA (U5.27), Connector (J1.3)
IOT 39A: FPGA (U5.26), Connector (J1.2)
IOT 41B: FPGA (U5.28), Connector (J1.4)
IOT 42B: FPGA (U5.31), Connector (J1.5)
IOT 43A: FPGA (U5.32), Connector (J1.6)
IOT 44B: FPGA (U5.34), Connector (J1.7)
IOT 45B G1: FPGA (U5.37), Connector (J1.67)
IOT 48B: FPGA (U5.36), Connector (J1.66)
IOT 49A: FPGA (U5.43), Connector (J1.68)
IOT 50B: FPGA (U5.38), Connector (J1.8)
IOT 51A: FPGA (U5.42), Connector (J1.9)
PA0: MCU (U7.20), Connector (J1.118)
PA1: MCU (U7.21), Connector (J1.60)
PA2: MCU (U7.22), Connector (J1.119)
PA3: MCU (U7.25), Connector (J1.120)
PA4: MCU (U7.26), Connector (J1.20)
PA5: MCU (U7.27), Connector (J1.21)
PA6: MCU (U7.28), Connector (J1.80)
PA7: MCU (U7.29), Connector (J1.22)
PA8: MCU (U7.69), Connector (J1.40)
PA9: MCU (U7.70), Connector (J1.41)
PA10: MCU (U7.71), Connector (J1.100)
PA15: MCU (U7.78), Connector (J1.101)
PB0: MCU (U7.32), Connector (J1.83)
PB1: MCU (U7.33), Connector (J1.24)
PB2: MCU (U7.34), Connector (J1.25)
PB4: MCU (U7.91), Connector (J1.48)
PB5: MCU (U7.92), Connector (J1.49)
PB6: MCU (U7.93), Connector (J1.108)
PB7: MCU (U7.94), Connector (J1.109)
PB9: MCU (U7.96), Connector (J1.50)
PB10: MCU (U7.47), Connector (J1.30)
PB11: MCU (U7.50), Connector (J1.31)
PB12: MCU (U7.51), Connector (J1.90)
PB13: MCU (U7.52), Connector (J1.91)
PB14: MCU (U7.53), Connector (J1.32)
PB15: MCU (U7.54), Connector (J1.33)
PC0: MCU (U7.15), Connector (J1.56)
PC1: MCU (U7.16), Connector (J1.57)
PC2: MCU (U7.17), Connector (J1.116)
PC3: MCU (U7.18), Connector (J1.58)
PC4: MCU (U7.30), Connector (J1.23)
PC5: MCU (U7.31), Connector (J1.82)
PC6: MCU (U7.65), Connector (J1.97)
PC7: MCU (U7.66), Connector (J1.38)
PC8: MCU (U7.67), Connector (J1.39)
PC9: MCU (U7.68), Connector (J1.98)
PC10: MCU (U7.79), Connector (J1.42)
PC11: MCU (U7.80), Connector (J1.43)
PC12: MCU (U7.81), Connector (J1.102)
PC13: MCU (U7.7), Connector (J1.55)
PD0: MCU (U7.82), Connector (J1.103)
PD1: MCU (U7.83), Connector (J1.44)
PD2: MCU (U7.84), Connector (J1.45)
PD3: MCU (U7.85), Connector (J1.104)
PD4: MCU (U7.86), Connector (J1.46)
PD5: MCU (U7.87), Connector (J1.47)
PD6: MCU (U7.88), Connector (J1.106)
PD7: MCU (U7.89), Connector (J1.107)
PD8: MCU (U7.55), Connector (J1.92)
PD9: MCU (U7.56), Connector (J1.34)
PD10: MCU (U7.57), Connector (J1.35)
PD11: MCU (U7.58), Connector (J1.94)
PD12: MCU (U7.59), Connector (J1.95)
PD13: MCU (U7.60), Connector (J1.36)
PD14: MCU (U7.61), Connector (J1.37)
PD15: MCU (U7.62), Connector (J1.96)
PE0: MCU (U7.97), Connector (J1.51)
PE1: MCU (U7.98), Connector (J1.110)
PE2: MCU (U7.1), Connector (J1.52)
PE3: MCU (U7.2), Connector (J1.53)
PE4: MCU (U7.3), Connector (J1.112)
PE5: MCU (U7.4), Connector (J1.113)
PE6: MCU (U7.5), Connector (J1.54)
PE7: MCU (U7.38), Connector (J1.84)
PE8: MCU (U7.39), Connector (J1.85)
PE9: MCU (U7.40), Connector (J1.26)
PE10: MCU (U7.41), Connector (J1.27)
PE11: MCU (U7.42), Connector (J1.86)
PE12: MCU (U7.43), Connector (J1.28)
PE13: MCU (U7.44), Connector (J1.29)
PE14: MCU (U7.45), Connector (J1.88)
PE15: MCU (U7.46), Connector (J1.89)
PF2: MCU (U7.19), Connector (J1.59)
PF9: MCU (U7.10), Connector (J1.114)
PF10: MCU (U7.11), Connector (J1.115)
SPI_FPGA_~{CS}: FPGA (U5.16), Flash (J2.1), Flash Programmer (R4.2 TP5.1)
USB_FT_N: USB (U14.4), Flash Programmer (R7.1)
USB_FT_P: USB (U14.3), Flash Programmer (R6.1)
USB_STM_N: MCU (U7.72), USB (U14.2)
USB_STM_P: MCU (U7.73), USB (U14.1)